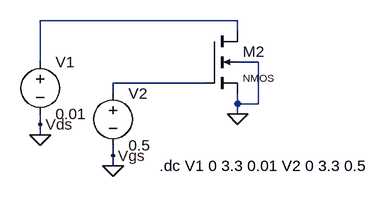
[diagram p0: schematic Draft1.asc]
Draft1.asc, the LTspice schematic file:
Version 4
SHEET 1 1524 776
WIRE 864 480 560 480
WIRE 864 496 864 480
WIRE 560 544 560 480
WIRE 896 544 864 544
WIRE 816 576 672 576
WIRE 672 592 672 576
WIRE 864 608 864 592
WIRE 896 608 896 544
WIRE 896 608 864 608
WIRE 864 624 864 608
WIRE 560 640 560 624
WIRE 560 656 560 640
WIRE 672 688 672 672
WIRE 672 704 672 688
FLAG 864 624 0
FLAG 672 704 0
FLAG 560 656 0
FLAG 560 640 Vds
FLAG 672 688 Vgs
SYMBOL Voltage 560 528 R0
SYMATTR InstName V1
SYMATTR Value 0.01
SYMBOL Voltage 672 576 R0
SYMATTR InstName V2
SYMATTR Value 0.5
SYMBOL nmos4 816 496 R0
WINDOW 3 56 72 Left 1
SYMATTR InstName M2
SYMATTR Value2 l=10u w=10u
TEXT 744 704 Left 2 !.dc V1 0 3.3 0.01 V2 0 3.3 0.5

The netlist it stands for:
* Draft1.asc
V1 N001 0 0.01
V2 N002 0 0.5
M2 N001 N002 0 0 NMOS l=10u w=10u
.model NMOS NMOS
.model PMOS PMOS
.lib standard.mos
.dc V1 0 3.3 0.01 V2 0 3.3 0.5
.backanno
.end